# EAGLE design Relay_Board_V3.4 (EAGLE 8.4.2)

## Sheet 1 of 2
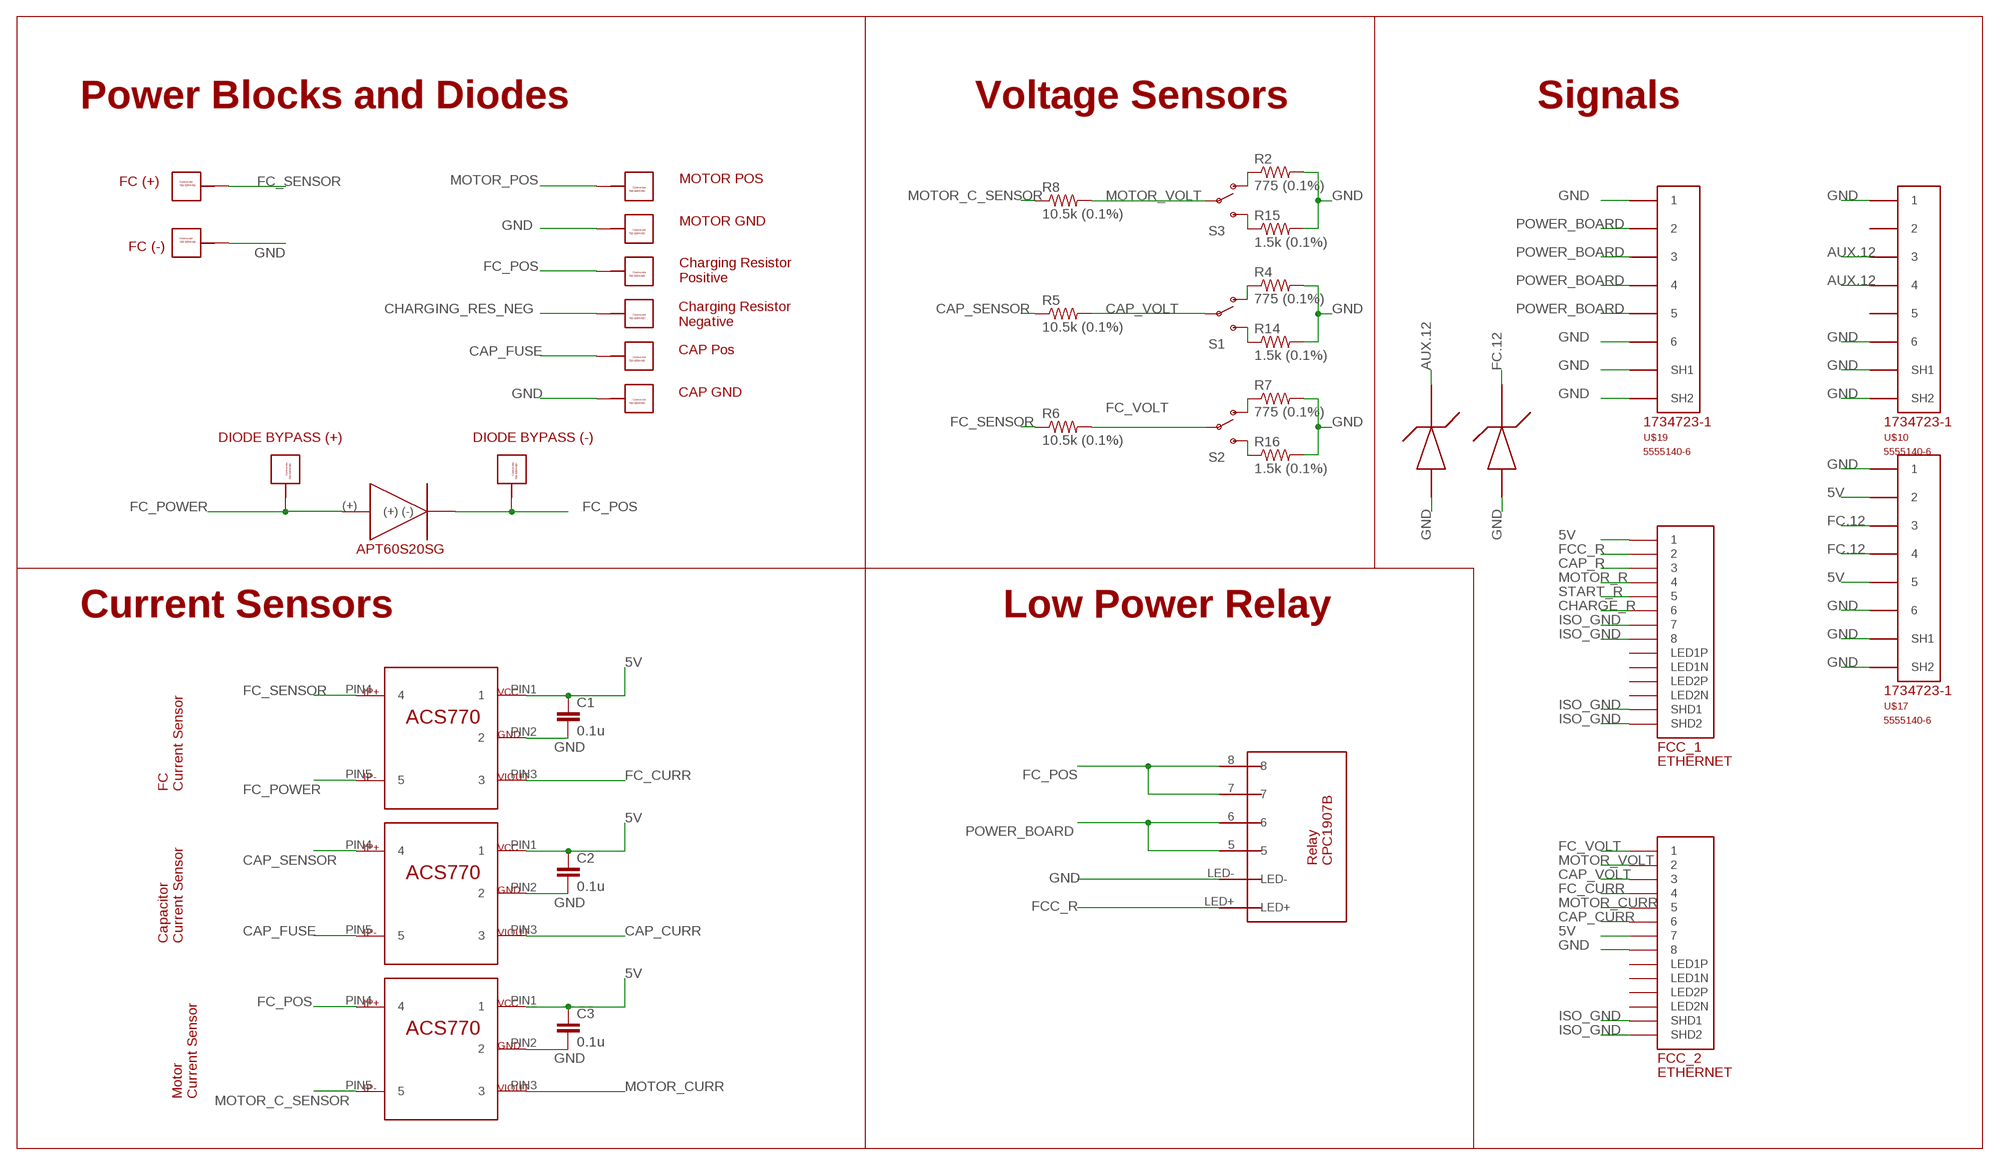
[diagram p0: schematic, sheet 1]

### Parts
C1  0.1u  CAP0603-CAP  [0603-CAP]
C2  0.1u  CAP0603-CAP  [0603-CAP]
C3  0.1u  CAP0603-CAP  [0603-CAP]
CAP.GND  732-3204-ND_CONNECTOR  [732-3204-ND]
CAP.POS  732-3204-ND_CONNECTOR  [732-3204-ND]
CAP.POS1  732-3204-ND_CONNECTOR  [732-3204-ND]
CAP.POS2  732-3204-ND_CONNECTOR  [732-3204-ND]
D1  APT60S20SG  [TO268]
FC.GND  732-3204-ND_CONNECTOR  [732-3204-ND]
FC.POS  732-3204-ND_CONNECTOR  [732-3204-ND]
FCC_1  ETHERNET  [A122645-ND]
FCC_2  ETHERNET  [A122645-ND]
MOTOR.GROUND  732-3204-ND_CONNECTOR  [732-3204-ND]
MOTOR.POSITIVE  732-3204-ND_CONNECTOR  [732-3204-ND]
R2  775 (0.1%)  R-US_R0805  [R0805]
R4  775 (0.1%)  R-US_R0805  [R0805]
R5  10.5k (0.1%)  R-US_R0805  [R0805]
R6  10.5k (0.1%)  R-US_R0805  [R0805]
R7  775 (0.1%)  R-US_R0805  [R0805]
R8  10.5k (0.1%)  R-US_R0805  [R0805]
R14  1.5k (0.1%)  R-US_R0805  [R0805]
R15  1.5k (0.1%)  R-US_R0805  [R0805]
R16  1.5k (0.1%)  R-US_R0805  [R0805]
RES.NEG  732-3204-ND_CONNECTOR  [732-3204-ND]
RES.POS  732-3204-ND_CONNECTOR  [732-3204-ND]
S1  SWITCH-SPDTPTH  [SWITCH-SPDT]
S2  SWITCH-SPDTPTH  [SWITCH-SPDT]
S3  SWITCH-SPDTPTH  [SWITCH-SPDT]
U$7  ACS770LCB_CURRENTSENSOR  [ACS770LCB_CURRENTSENSOR]
U$8  ACS770LCB_CURRENTSENSOR  [ACS770LCB_CURRENTSENSOR]
U$9  ACS770LCB_CURRENTSENSOR  [ACS770LCB_CURRENTSENSOR]
U$10  5555140-6  [1734723-1_RJ11]
U$15  P6KE15A-E3/54GICT-ND_TVS_DIODE  [P6KE15A-E3/54GICT-ND_TVS_DIODE]
U$16  P6KE15A-E3/54GICT-ND_TVS_DIODE  [P6KE15A-E3/54GICT-ND_TVS_DIODE]
U$17  5555140-6  [1734723-1_RJ11]
U$19  5555140-6  [1734723-1_RJ11]
U$22  RELAY-CPC1907B  [RELAY-CPC1907B]

### Nets
5V: C1.1 C2.1 C3.1 FCC_1.P$1 FCC_2.P$7 U$7.PIN1 U$8.PIN1 U$9.PIN1 U$17.2 U$17.5
AUX.12: U$10.3 U$10.4 U$16.P$2(P(-)) ; also sheet 2
CAP_CURR: FCC_2.P$6 U$8.PIN3
CAP_FUSE: CAP.POS.P$1 CAP.POS.P$2 CAP.POS.P$3 CAP.POS.P$4 CAP.POS.P$5 CAP.POS.P$6 CAP.POS.P$7 CAP.POS.P$8 CAP.POS.P$9 CAP.POS.P$10 U$8.PIN5
CAP_R: FCC_1.P$3 ; also sheet 2
CAP_SENSOR: R5.1 U$8.PIN4 ; also sheet 2
CAP_VOLT: FCC_2.P$3 R5.2 S1.2(P)
CHARGE_R: FCC_1.P$6 ; also sheet 2
CHARGING_RES_NEG: RES.NEG.P$1 RES.NEG.P$2 RES.NEG.P$3 RES.NEG.P$4 RES.NEG.P$5 RES.NEG.P$6 RES.NEG.P$7 RES.NEG.P$8 RES.NEG.P$9 RES.NEG.P$10 ; also sheet 2
FC.12: U$15.P$2(P(-)) U$17.3 U$17.4 ; also sheet 2
FC_CURR: FCC_2.P$4 U$7.PIN3
FC_POS: CAP.POS2.P$1 CAP.POS2.P$2 CAP.POS2.P$3 CAP.POS2.P$4 CAP.POS2.P$5 CAP.POS2.P$6 CAP.POS2.P$7 CAP.POS2.P$8 CAP.POS2.P$9 CAP.POS2.P$10 D1.(-) D1.C@1((-)) D1.C@2((-)) RES.POS.P$1 RES.POS.P$2 RES.POS.P$3 RES.POS.P$4 RES.POS.P$5 RES.POS.P$6 RES.POS.P$7 RES.POS.P$8 RES.POS.P$9 RES.POS.P$10 U$9.PIN4 U$22.7 U$22.8 ; also sheet 2
FC_POWER: CAP.POS1.P$1 CAP.POS1.P$2 CAP.POS1.P$3 CAP.POS1.P$4 CAP.POS1.P$5 CAP.POS1.P$6 CAP.POS1.P$7 CAP.POS1.P$8 CAP.POS1.P$9 CAP.POS1.P$10 D1.(+) U$7.PIN5
FC_SENSOR: FC.POS.P$1 FC.POS.P$2 FC.POS.P$3 FC.POS.P$4 FC.POS.P$5 FC.POS.P$6 FC.POS.P$7 FC.POS.P$8 FC.POS.P$9 FC.POS.P$10 R6.1 U$7.PIN4
FC_VOLT: FCC_2.P$1 R6.2 S2.2(P)
FCC_R: FCC_1.P$2 U$22.LED+
GND: C1.2 C2.2 C3.2 CAP.GND.P$1 CAP.GND.P$2 CAP.GND.P$3 CAP.GND.P$4 CAP.GND.P$5 CAP.GND.P$6 CAP.GND.P$7 CAP.GND.P$8 CAP.GND.P$9 CAP.GND.P$10 FC.GND.P$1 FC.GND.P$2 FC.GND.P$3 FC.GND.P$4 FC.GND.P$5 FC.GND.P$6 FC.GND.P$7 FC.GND.P$8 FC.GND.P$9 FC.GND.P$10 FCC_2.P$8 MOTOR.GROUND.P$1 MOTOR.GROUND.P$2 MOTOR.GROUND.P$3 MOTOR.GROUND.P$4 MOTOR.GROUND.P$5 MOTOR.GROUND.P$6 MOTOR.GROUND.P$7 MOTOR.GROUND.P$8 MOTOR.GROUND.P$9 MOTOR.GROUND.P$10 R2.2 R4.2 R7.2 R14.2 R15.2 R16.2 U$7.PIN2 U$8.PIN2 U$9.PIN2 U$10.1 U$10.6 U$10.SH1 U$10.SH2 U$15.P$1(P(+)) U$16.P$1(P(+)) U$17.1 U$17.6 U$17.SH1 U$17.SH2 U$19.1 U$19.6 U$19.SH1 U$19.SH2 U$22.LED- ; also sheet 2
ISO_GND: FCC_1.P$7 FCC_1.P$8 FCC_1.P$13(SHD1) FCC_1.P$14(SHD2) FCC_2.P$13(SHD1) FCC_2.P$14(SHD2) ; also sheet 2
MOTOR_C_SENSOR: R8.1 U$9.PIN5 ; also sheet 2
MOTOR_CURR: FCC_2.P$5 U$9.PIN3
MOTOR_POS: MOTOR.POSITIVE.P$1 MOTOR.POSITIVE.P$2 MOTOR.POSITIVE.P$3 MOTOR.POSITIVE.P$4 MOTOR.POSITIVE.P$5 MOTOR.POSITIVE.P$6 MOTOR.POSITIVE.P$7 MOTOR.POSITIVE.P$8 MOTOR.POSITIVE.P$9 MOTOR.POSITIVE.P$10 ; also sheet 2
MOTOR_R: FCC_1.P$4 ; also sheet 2
MOTOR_VOLT: FCC_2.P$2 R8.2 S3.2(P)
N$9: R4.1 S1.1(O)
N$10: R14.1 S1.3(S)
N$11: R2.1 S3.1(O)
N$12: R15.1 S3.3(S)
N$16: R7.1 S2.1(O)
N$17: R16.1 S2.3(S)
POWER_BOARD: U$19.2 U$19.3 U$19.4 U$19.5 U$22.5 U$22.6
START_R: FCC_1.P$5 ; also sheet 2
Unconnected: FCC_1.P$9(LED1N) FCC_1.P$10(LED1P) FCC_1.P$11(LED2N) FCC_1.P$12(LED2P) FCC_2.P$9(LED1N) FCC_2.P$10(LED1P) FCC_2.P$11(LED2N) FCC_2.P$12(LED2P) U$10.2 U$10.5

### Notes on the sheet
- Power Blocks and Diodes | Voltage Sensors | Signals
- FC (+) | MOTOR POS
- MOTOR GND
- FC (-)
- Charging Resistor
  Positive
- Charging Resistor
  Negative
- CAP Pos
- CAP GND
- DIODE BYPASS (+) | DIODE BYPASS (-)
- Current Sensors | Low Power Relay
- FC
  Current Sensor
- Capacitor
  Current Sensor
- Motor
  Current Sensor

## Sheet 2 of 2
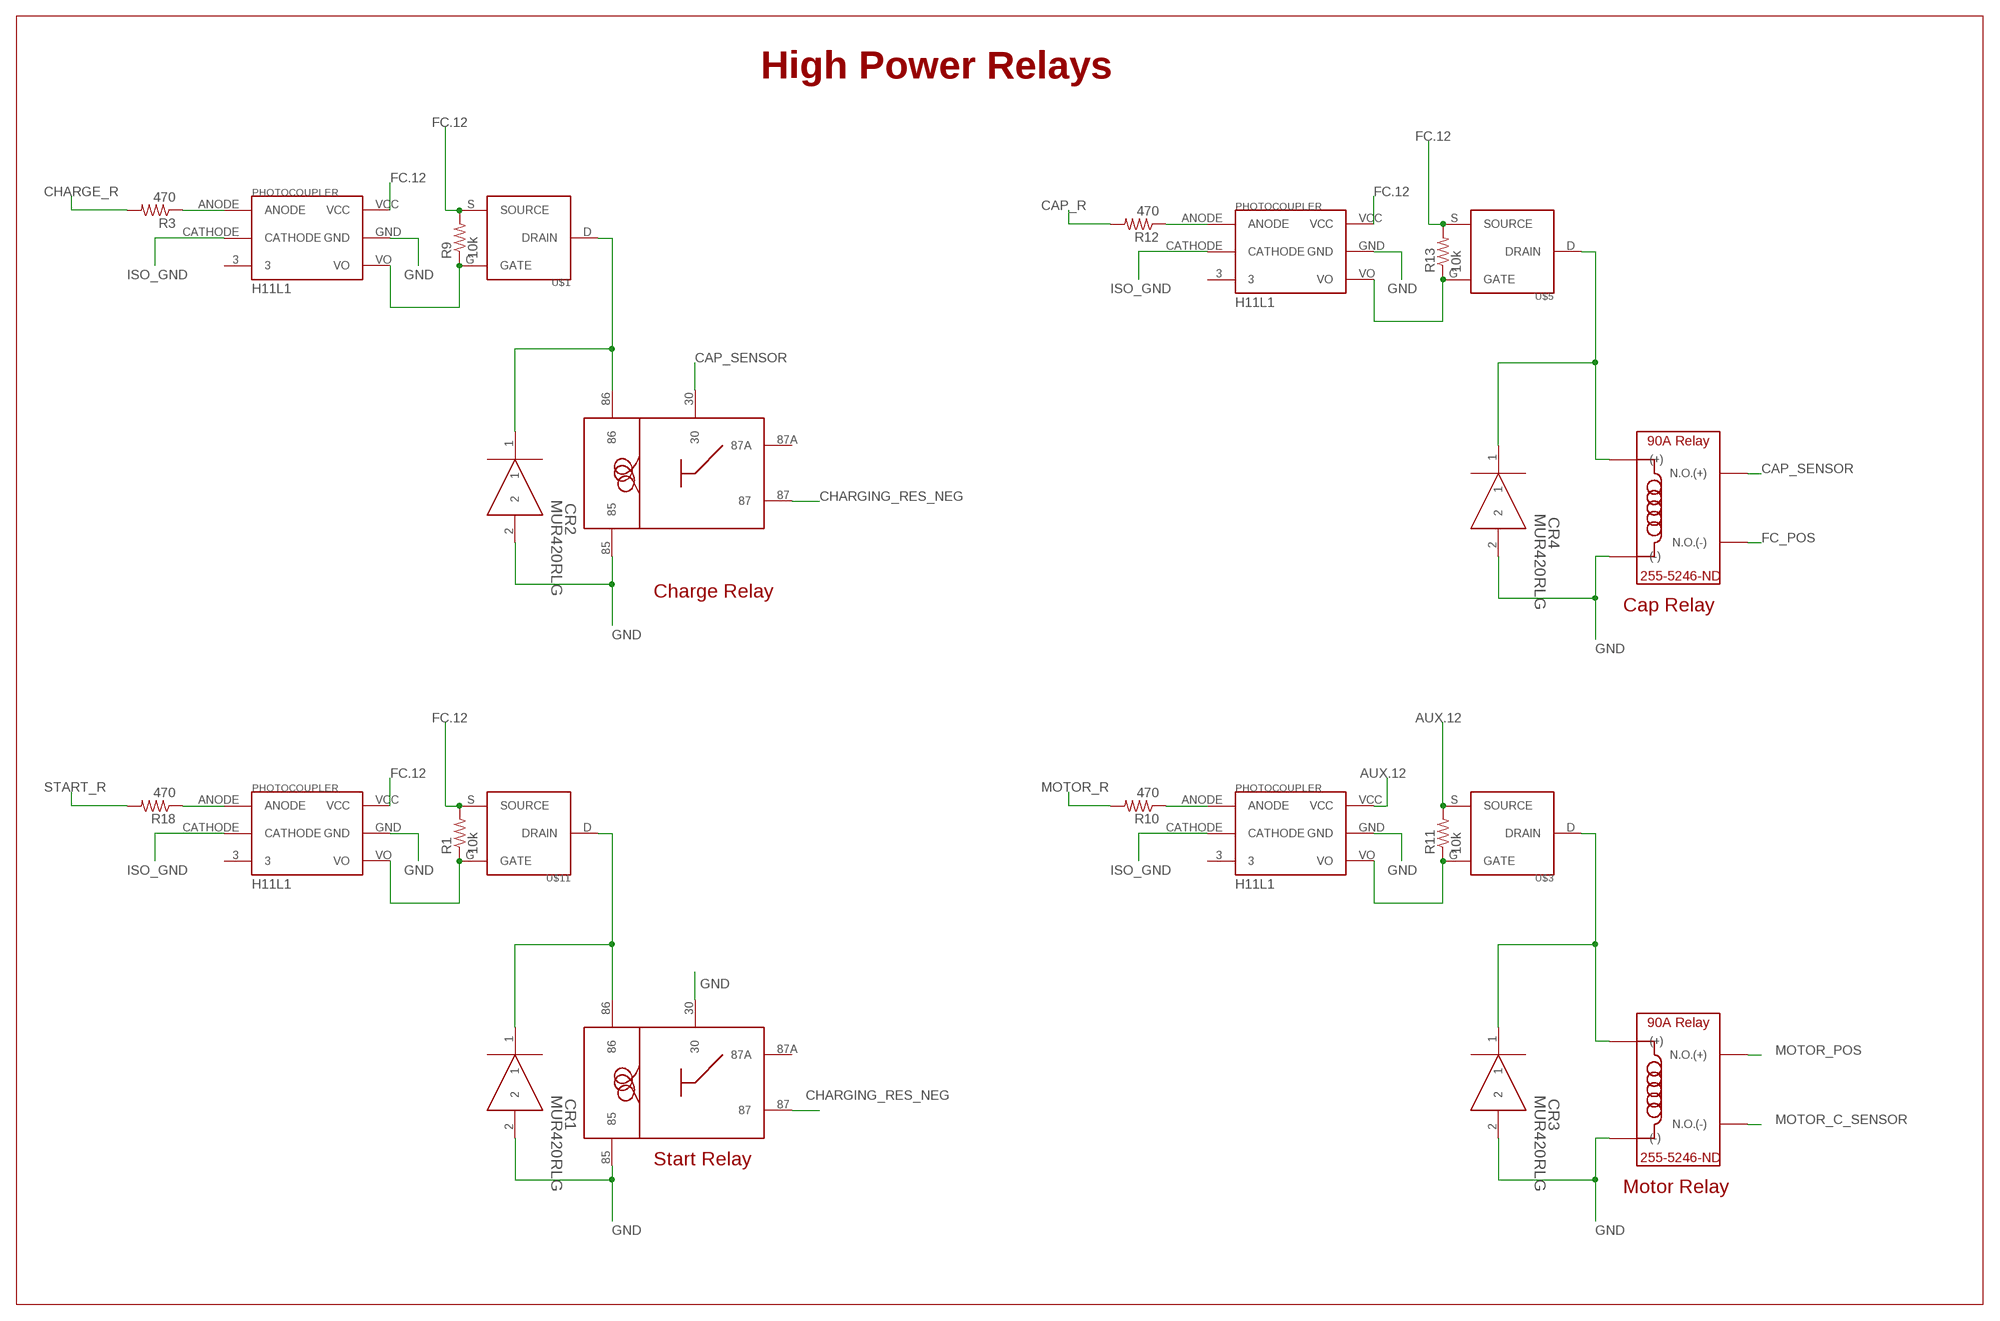
[diagram p1: schematic, sheet 2]

### Parts
CR1  MUR420RLG  [DO-201AD]
CR2  MUR420RLG  [DO-201AD]
CR3  MUR420RLG  [DO-201AD]
CR4  MUR420RLG  [DO-201AD]
R1  10k  RESISTOR0603-RES  [0603-RES]
R3  470  RESISTOR0603-RES  [0603-RES]
R9  10k  RESISTOR0603-RES  [0603-RES]
R10  470  RESISTOR0603-RES  [0603-RES]
R11  10k  RESISTOR0603-RES  [0603-RES]
R12  470  RESISTOR0603-RES  [0603-RES]
R13  10k  RESISTOR0603-RES  [0603-RES]
R18  470  RESISTOR0603-RES  [0603-RES]
START.RELAY1  VCF4-1000  [VCF4-1000]
START.RELAY2  VCF4-1000  [VCF4-1000]
U$1  DMP3056L-7DMP3056L-7  [DMP3056L-7]
U$2  H11L1H11L1  [H11L1]
U$3  DMP3056L-7DMP3056L-7  [DMP3056L-7]
U$4  H11L1H11L1  [H11L1]
U$5  DMP3056L-7DMP3056L-7  [DMP3056L-7]
U$6  H11L1H11L1  [H11L1]
U$11  DMP3056L-7DMP3056L-7  [DMP3056L-7]
U$12  H11L1H11L1  [H11L1]
U$13  255-5246-ND  [255-5246-ND]
U$14  255-5246-ND  [255-5246-ND]

### Nets
AUX.12: R11.2 U$3.S(SOURCE) U$4.VCC ; also sheet 1
CAP_R: R12.2 ; also sheet 1
CAP_SENSOR: START.RELAY2.30 U$13.NO(+)(N.O.(+)) U$13.NO(++)(N.O.(+)) ; also sheet 1
CHARGE_R: R3.2 ; also sheet 1
CHARGING_RES_NEG: START.RELAY1.87 START.RELAY2.87 ; also sheet 1
FC.12: R1.2 R9.2 R13.2 U$1.S(SOURCE) U$2.VCC U$5.S(SOURCE) U$6.VCC U$11.S(SOURCE) U$12.VCC ; also sheet 1
FC_POS: U$13.NO(-)(N.O.(-)) U$13.NO(--)(N.O.(-)) ; also sheet 1
GND: CR1.2 CR2.2 CR3.2 CR4.2 START.RELAY1.30 START.RELAY1.85 START.RELAY2.85 U$2.GND U$4.GND U$6.GND U$12.GND U$13.(-) U$13.(--)((-)) U$14.(-) U$14.(--)((-)) ; also sheet 1
ISO_GND: U$2.CATHODE U$4.CATHODE U$6.CATHODE U$12.CATHODE ; also sheet 1
MOTOR_C_SENSOR: U$14.NO(-)(N.O.(-)) U$14.NO(--)(N.O.(-)) ; also sheet 1
MOTOR_POS: U$14.NO(+)(N.O.(+)) U$14.NO(++)(N.O.(+)) ; also sheet 1
MOTOR_R: R10.2 ; also sheet 1
N$1: R9.1 U$1.G(GATE) U$2.VO
N$2: R3.1 U$2.ANODE
N$3: CR2.1 START.RELAY2.86 U$1.D(DRAIN)
N$4: R11.1 U$3.G(GATE) U$4.VO
N$5: R10.1 U$4.ANODE
N$6: CR3.1 U$3.D(DRAIN) U$14.(+) U$14.(++)((+))
N$7: R13.1 U$5.G(GATE) U$6.VO
N$8: R12.1 U$6.ANODE
N$13: CR4.1 U$5.D(DRAIN) U$13.(+) U$13.(++)((+))
N$21: R1.1 U$11.G(GATE) U$12.VO
N$23: R18.1 U$12.ANODE
N$30: CR1.1 START.RELAY1.86 U$11.D(DRAIN)
START_R: R18.2 ; also sheet 1
Unconnected: START.RELAY1.87A START.RELAY2.87A U$2.3 U$4.3 U$6.3 U$12.3

### Notes on the sheet
- High Power Relays
- Charge Relay
- Cap Relay
- Start Relay
- Motor Relay

## Library data of the parts
C1-C3 = SparkFun-Passives:CAP: Capacitor Standard 0603 ceramic capacitor, and 0.1" leaded capacitor.
CAP.GND CAP.POS CAP.POS1 CAP.POS2 FC.GND FC.POS MOTOR.GROUND MOTOR.POSITIVE RES.NEG RES.POS = Connector 732-3204:732-3204-ND_CONNECTOR
CR1-CR4 = MUR420RLG - Diode:MUR420RLG; MANUFACTURER_PART_NUMBER: MUR420RLG; VENDOR: ON Semiconductor
D1 = Diode - APT60S20SG:APT60S20SG
FCC_1 FCC_2 = ETHERNET-3:ETHERNET: Ethernet port with 2 leds. digikey number A122645-ND
R1 R3 R9-R13 R18 = SparkFun:RESISTOR: Resistor Basic schematic elements and footprints for 0603, 1206, and PTH resistors.
R2 R4-R8 R14-R16 = Resistor:R-US_: RESISTOR, American symbol
S1-S3 = SparkFun-Electromechanical:SWITCH-SPDT: SPDT Switch Simple slide switch, Spark Fun Electronics SKU : COM-00102 DPDT SMT slide switch, AYZ0202, SWCH-08179; PROD_ID: SWCH-08261
START.RELAY1 START.RELAY2 = VCF4-1000:VCF4-1000: Part for the VCF4-1000 relay socket. Digi-Key Part Number: PB232-ND. Pin numbering is directly taken from the data sheet of the relay. Relay Digi-Key Part Number: 255-2083-ND (Also works with 255-1825-ND). If using relay 255-1825-ND, ignore pin 87A.
U$1 U$3 U$5 U$11 = DMP3056L-7:DMP3056L-7
U$2 U$4 U$6 U$12 = FCC_parts:H11L1
U$7-U$9 = ACS770 Current Sensor:ACS770LCB_CURRENTSENSOR
U$10 U$17 U$19 = 5555140-6 RJ11:5555140-6
U$13 U$14 = Relay 255-5246-ND:255-5246-ND
U$15 U$16 = TVS Diode Through-Hole:P6KE15A-E3/54GICT-ND_TVS_DIODE
U$22 = Relay_CPC1907B:RELAY-CPC1907B

## Board
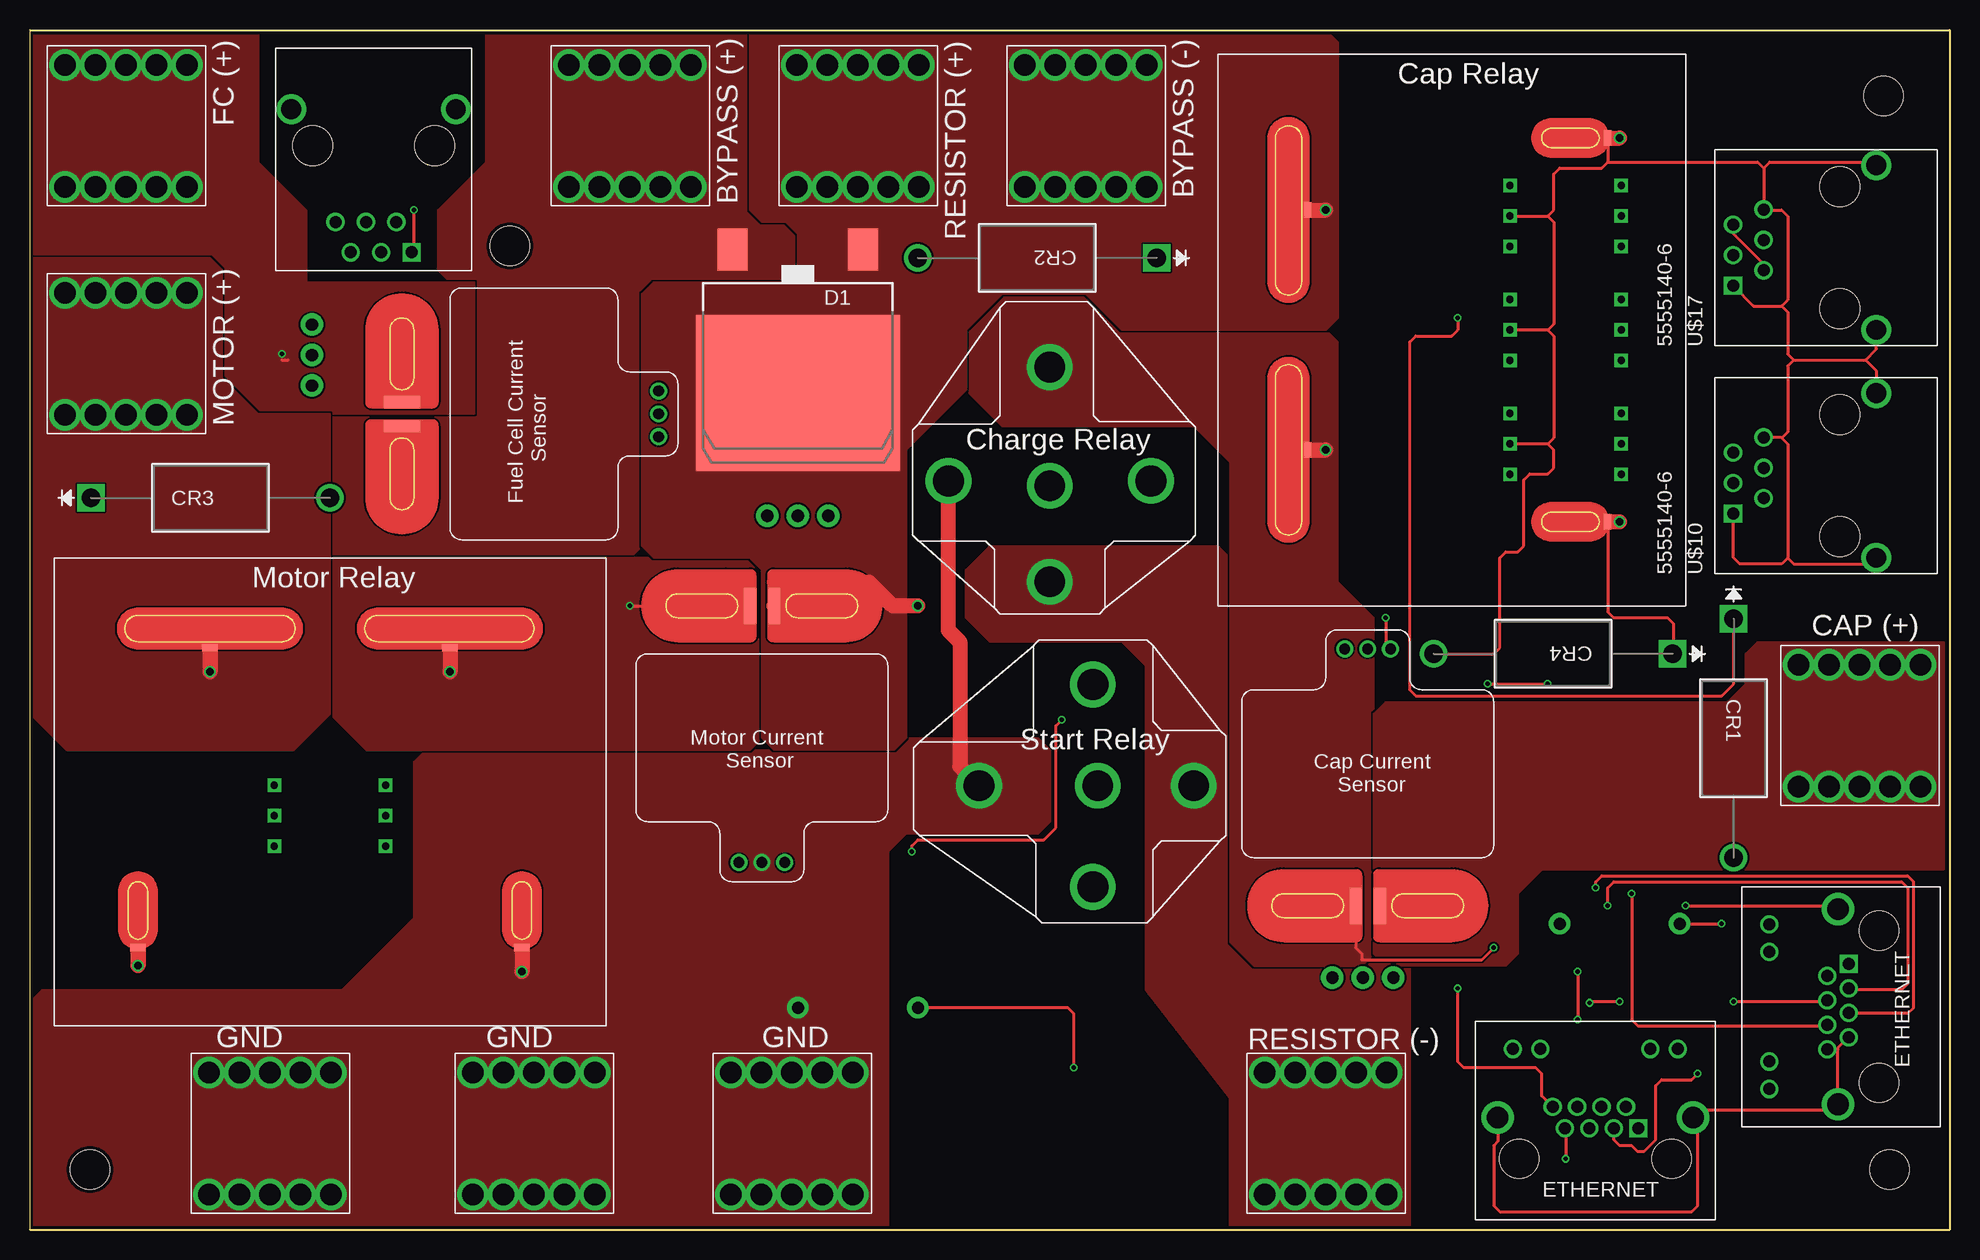
[diagram p2: board, top side]
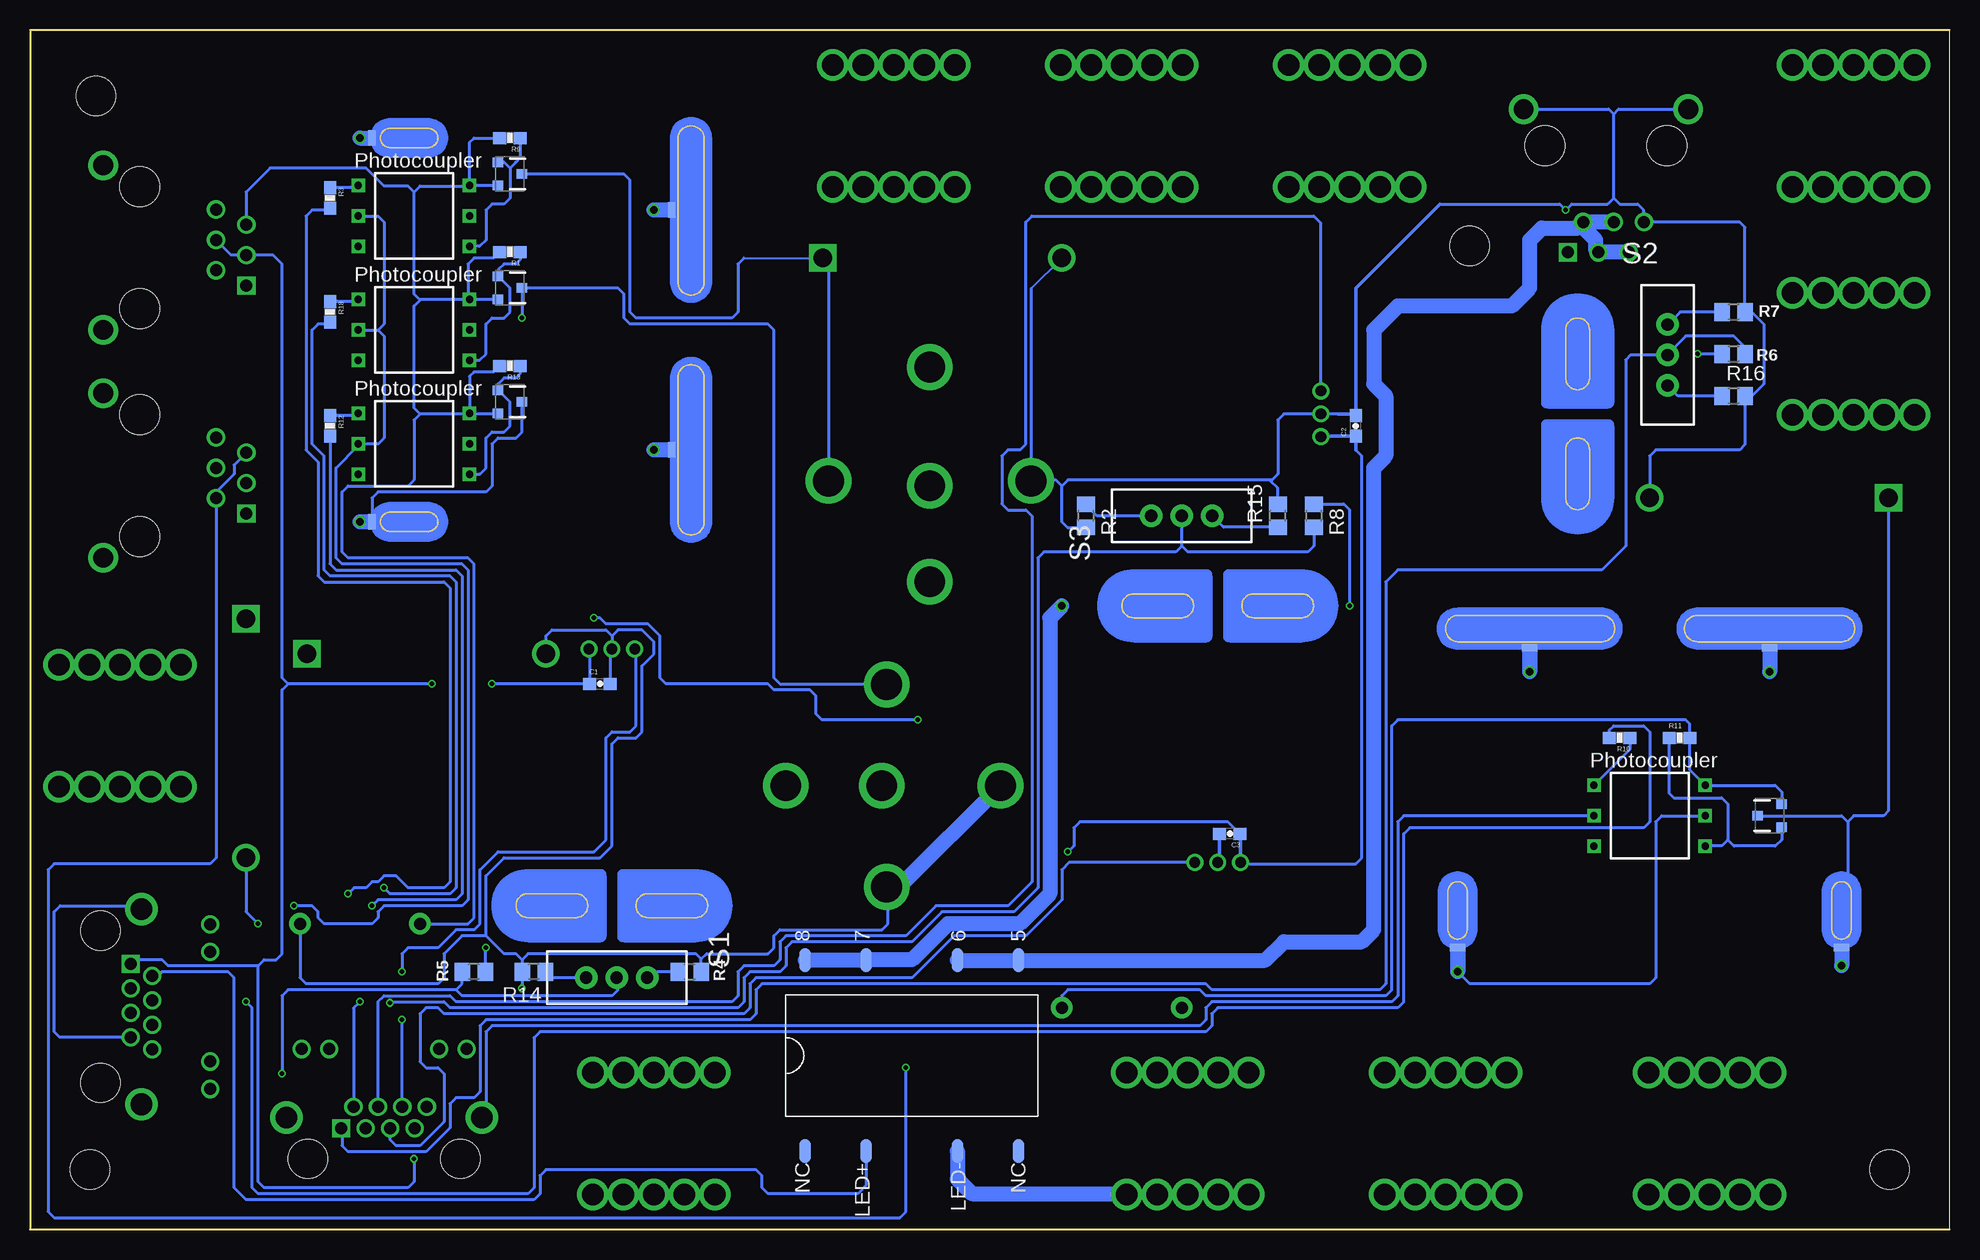
[diagram p3: board, bottom side, seen from below]

Size 160 x 100 mm. Coordinates in mm from the lower left corner, seen from the top.
Outline: 0,0 0,100 160,100 160,0 0,0
Copper layers (1*16): Top 0.035mm / dielectric 1.5mm / Bottom 0.035mm
Design rules "SeeedStudio_2layer_DRU_no_angle_20140221": minimum track width 6mil, minimum drill 12mil, track to track 6mil, track to pad 6mil, pad to pad 6mil, via to via 6mil, smd to smd 0mil, copper to edge 10mil, drill to drill 10mil, minimum pad ring 10mil, minimum via ring 6mil, stop-mask expansion 2mil, vias tented up to drill 100mil, thermal gap 10mil

### Footprints (pad centres in the part's own frame; a part is rotated, then mirrored left to right if it is on the bottom)
0603-CAP = smd 1.1 x 1: 1 -0.85,0; 2 0.85,0
732-3204-ND = drill 1.76: P$1 -5.08,5.08; P$2 -2.54,5.08; P$3 0,5.08; P$4 2.54,5.08; P$5 5.08,5.08; P$6 5.08,-5.08; P$7 2.54,-5.08; P$8 0,-5.08; P$9 -2.54,-5.08; P$10 -5.08,-5.08
DO-201AD = drill 1.549 pad 2.057 square: 1 -19.914,0 | drill 1.549 pad 2.057: 2 0,0
TO268 = smd 2.5 x 3.5: (+) 5.45,-9.7; (-) -5.45,-9.7 | smd 8.5 x 13: C@1 -4.25,2.25; C@2 4.25,2.25
A122645-ND = drill 1 square: P$1 3.58,2.54 | drill 1: P$2 2.56,4.32; P$3 1.54,2.54; P$4 0.52,4.32; P$5 -0.5,2.54; P$6 -1.52,4.32; P$7 -2.54,2.54; P$8 -3.56,4.32; P$9 -6.86,9.14; P$10 -4.57,9.14; P$11 4.57,9.14; P$12 6.86,9.14 | drill 1.8: P$13 -8.13,3.43; P$14 8.13,3.43 | hole 3.25: -6.35,0; 6.35,0
0603-RES = smd 1.1 x 1: 1 -0.85,0; 2 0.85,0
R0805 = smd 1.3 x 1.5: 1 -0.95,0; 2 0.95,0
SWITCH-SPDT = drill 1.016 pad 1.88: 1 0,2.54; 2 0,0; 3 0,-2.54
VCF4-1000 = drill 2.57 pad 3.81: 30 -17.9,0; 85 -8.407,-8.445; 86 -8.407,8.445; 87 0,0; 87A -8,0
DMP3056L-7 = smd 0.8 x 0.9: D 0,1; G -0.95,-1; S 0.95,-1
H11L1 = drill 0.6 square: 3 -4.635,-2.54; ANODE -4.635,2.54; CATHODE -4.635,0; GND 4.635,0; VCC 4.635,2.54; VO 4.635,-2.54
ACS770LCB_CURRENTSENSOR = drill 0.9: PIN1 -1.91,-21.4; PIN2 0,-21.4; PIN3 1.91,-21.4 | smd 1 x 3: PIN4 1,0; PIN5 -1,0
1734723-1_RJ11 = drill 1 square: 1 -3.81,2.54 | drill 1: 2 -1.27,2.54; 3 1.27,2.54; 4 -2.54,0; 5 0,0; 6 2.54,0 | drill 1.65: SH1 -7.5,-9.4; SH2 6.22,-9.4 | hole 3.3: -5.72,-6.35; 4.44,-6.35
255-5246-ND = smd 1.27 x 0.635: (+) -16,-25.5; (-) 16,-25.5; NO(+) -10,-0.5; NO(-) 10,-0.5 | smd 1.27 x 0.635 bottom: (++) -16,-25.5; (--) 16,-25.5; NO(++) -10,-0.5; NO(--) 10,-0.5
P6KE15A-E3/54GICT-ND_TVS_DIODE = drill 1 pad 1.778: P$1 -5,0; P$2 5,0
STAND-OFF = hole 3.302: 0,0
RELAY-CPC1907B = smd 2 x 0.95: 5 7.95,-8.891; 6 7.95,-3.809; 7 7.95,3.811; 8 7.95,8.891; LED+ -7.95,3.811; LED- -7.95,-3.811; NC_1 -7.95,8.891; NC_2 -7.95,-8.891

### Placement (x,y rotation side)
C1  112.5,45.5 0 bottom
C2  49.5,67 90 bottom
C3  60,33 180 bottom
CAP.GND  20,8 0 top
CAP.POS  152.5,42 0 top
CAP.POS1  50,92 0 top
CAP.POS2  88,92 0 top
CR1  142,31 270 top
CR2  74,81 180 top
CR3  25,61 0 top
CR4  117,48 180 top
D1  64,72 180 top
FC.GND  63.5,8 0 top
FC.POS  8,92 0 top
FCC_1  154.13,18.57 90 top
FCC_2  130.48,5.9 0 top
MOTOR.GROUND  42,8 0 top
MOTOR.POSITIVE  8,73 0 top
R1  120,81.5 180 bottom
R2  72,59.5 270 bottom
R3  135,86 270 bottom
R4  105,21.5 0 bottom
R5  123,21.5 180 bottom
R6  18,73 0 bottom
R7  18,76.5 0 bottom
R8  53,59.5 270 bottom
R9  120,91 180 bottom
R10  27.5,41 180 bottom
R11  22.5,41 0 bottom
R12  135,67 270 bottom
R13  120,72 180 bottom
R14  118,21.5 180 bottom
R15  56,59.5 90 bottom
R16  18,69.5 0 bottom
R18  135,76.5 270 bottom
RES.NEG  108,8 0 top
RES.POS  69,92 0 top
S1  111.1,21 270 bottom
S2  23.5,72.9 0 bottom
S3  64,59.5 90 bottom
START.RELAY1  97,37 0 top
START.RELAY2  85,54 270 top
U$1  120,88 270 bottom
U$2  128,84.5 0 bottom
U$3  15,34.5 90 bottom
U$4  25,34.5 0 bottom
U$5  120,69 270 bottom
U$6  128,65.5 0 bottom
U$7  31,68 90 top
U$8  111.5,27 180 top
U$9  61,52 0 top
U$10  144.5,63.5 90 top
U$11  120,78.5 270 bottom
U$12  128,75 0 bottom
U$13  106,75 90 top
U$14  25,49 0 top
U$15  132.5,25.5 180 top
U$16  69,18.5 0 top
U$17  144.5,82.5 90 top
U$18  [STAND-OFF]  5,5 0 top
U$19  28,84 180 top
U$20  [STAND-OFF]  155,5 0 top
U$21  [STAND-OFF]  154.5,94.5 0 top
U$22  86.5,14.5 90 bottom
U$23  [STAND-OFF]  40,82 0 top

### Tracks (layer width: path | path; a pad name or v marks a point on that pad's centre or on a via)
5V  (via drill 0.35)
  Top 0.254: v121.5,45.5 v126.5,45.5 | FCC_2.P$7 128,8.38 v128,5.89 | v73.5,31.5 73.5,32 74,32.5 84.5,32.5 85.5,33.5 85.5,42 v86,42.5 | v113,51 113,49 U$8.PIN1
  Bottom 0.254: U$9.PIN1 59,30.5 49.5,30.5 49,31 49,64.5 49.5,65 | U$8.PIN1 113.35,48.34 C1.1 v121.5,45.5 | 138.5,45.5 139,45 139,23 139.5,22.5 140.5,22.5 141,22 | v126.5,45.5 138.5,45.5 | 138.5,45.5 139,46 139,80 139,80.5 139.73,81.23 U$17.2 143.23,81.23 U$17.5 | v128,5.89 128,4 128.5,3.5 140.5,3.5 141,4 141,22 | 141,22 148.5,22 149,22.5 151,22.5 151.35,22.15 FCC_1.P$1 | C3.1 60.15,34 72.5,34 73,33.5 73,32 v73.5,31.5 | v86,42.5 94,42.5 94.5,43 94.5,44.5 95,45 98,45 98.5,45.5 107,45.5 107.5,46 107.5,49.5 108.5,50.5 112,50.5 112.5,51 v113,51
  Bottom 0.305: 49.5,65 C2.1 52.34,66.15 U$7.PIN1 | C3.1 59.09,32.95 U$9.PIN1
AUX.12  (via drill 0.35)
  Top 0.254: v87,13.5 87,18 86.5,18.5 U$16.P$2
  Bottom 0.254: U$3.S 14,36.5 14.54,37.04 U$4.VCC 21.65,38.33 R11.2 21.65,42.15 22,42.5 46,42.5 46.5,42 46.5,20 47,19.5 62,19.5 62.5,20 73.5,20 74,19.5 U$16.P$2 | v87,13.5 87,1.5 87.5,1 158,1 158.5,1.5 158.5,30 158,30.5 145,30.5 144.5,31 U$10.4 144.5,61.5 143,63 143,63.73 U$10.3
CAP_CURR  (via drill 0.35)
  Top 0.254: v129,21.5 v129,17.5
  Bottom 0.254: U$8.PIN3 109.5,48.31 109.5,42 110,41.5 111.5,41.5 112,41 112,32.5 113,31.5 121,31.5 122.5,30 122.5,25.5 123,25 124.5,25 126,23.5 128.5,23.5 129,23 v129,21.5 | FCC_2.P$6 129,10.26 v129,17.5
CAP_FUSE
  pour Top (no thermals): 113,22 112,23 112,43 113,44 141.5,44 143,45.5 143,48 144,49 159.5,49 159.5,30 126,30 124,28 124,23 123,22
CAP_R  (via drill 0.35)
  Top 0.254: v131.5,27 131.5,28.5 132,29 156,29 156.5,28.5 156.5,20.5 156,20 151.7,20 FCC_1.P$3
  Bottom 0.254: R12.2 135,55.5 134.5,55 124.5,55 124,54.5 124,28 124.5,27.5 131,27.5 v131.5,27
CAP_SENSOR  (via drill 0.35, 0.65)
  Top 0.254: U$8.PIN4 110.5,23.5 111,23 111,22.5 121,22.5 v122,23.5
  Top 1.27: U$13.NO(++) v108,65
  Bottom 0.254: v122,23.5 122.05,23.45 R5.1
  Bottom 1.27: U$13.NO(++) v108,65
  pour Top (rank 2, no thermals): 78,70 81,67 97,67 98,66 100,64 100,25 100,24 102,22 111,22 112,23 112,43 112,51 110,53 109,54 109,74 108,75 91,75 88,78 81,78 78,75
CAP_VOLT  (via drill 0.35)
  Top 0.254: v139,13 138.5,12.5 136,12.5 135.5,12 135.5,7.5 134.5,6.5 134,6.5 133.5,7 132.5,7 132.02,7.48 FCC_2.P$3
  Bottom 0.254: S1.2 111.1,20.1 111,20 111.5,19.5 124,19.5 124.5,20 | v139,13 139,19.5 138.5,20 124.5,20 | R5.2 124,21.45 124,20.5 124.5,20
CHARGE_R  (via drill 0.35)
  Top 0.254: v133.5,28 133.5,17.5 134,17 149.76,17 FCC_1.P$6
  Bottom 0.254: R3.2 135.15,85 136.5,85 137,84.5 137,65 136,64 136,54.5 135.5,54 125.5,54 125,53.5 125,29 125.5,28.5 128.5,28.5 129.5,29.5 130.5,29.5 131,29 131.5,29 132,28.5 133,28.5 v133.5,28
CHARGING_RES_NEG
  pour Top (rank 4, no thermals): 78,51 78,55 80,57 99,57 101,55 101,23.5 115,23.5 115,0 100,0 100,11 93,20 93,47 91,49 80,49
FC.12
  Top 0.254: U$17.4 144.5,80.5 142,83 142,83.73 U$17.3
  Bottom 0.254: U$1.S U$2.VCC | U$6.VCC U$5.S | U$11.S U$12.VCC 123.5,77.54 | 127.5,68 128,67.5 128,62.5 128.5,62 133.5,62 134,61.5 134,56.5 133.5,56 123.5,56 123,55.5 123,26 123.5,25.5 U$15.P$2 | U$6.VCC 123.41,68 127.5,68 | 127.5,68 128,68.5 128,77 127.5,77.5 | 127.5,77.5 128,78 128,86.5 | 128,86.5 127.5,87 123.41,87 U$2.VCC | 123.5,77.54 127.46,77.54 127.5,77.5 | 121,81.5 R1.2 121.35,81 123,81 123.5,80.5 123.5,77.54 | R9.2 123,91 123.36,90.64 U$2.VCC | R13.2 121.35,71.5 123,71.5 123.36,71.14 U$6.VCC | 128,86.5 128.5,87 130.5,87 132,88.5 140,88.5 142,86.5 142,83.81 U$17.3
FC_CURR
  Bottom 0.254: U$7.PIN3 52.4,83.9 53,84.5 76.5,84.5 77,84 77,65.5 77.5,65 78.5,65 79,64.5 79,60.5 78.5,60 77,60 76.5,59.5 76.5,29 78.5,27 84.5,27 87,24.5 97,24.5 97.5,24 97.5,22.5 98,22 100.5,22 101,21.5 101,19.5 101.5,19 124.5,19 125,19.5 130.5,19.5 131,19 FCC_2.P$4
FC_POS  (via drill 0.65)
  Top 1.27: v74,52 71.91,52 69.95,53.95 62.05,53.95 62.05,52.05 U$9.PIN4 | U$13.NO(--) v108,85
  Bottom 1.27: U$22.8 U$22.7 90.26,22.5 86.5,22.5 83.5,25.5 77.5,25.5 75,28 75,51 v74,52 | U$13.NO(--) v108,85
  pour Top (no thermals): 52,56 51,57 51,78 52,79 63,79 64,80 64,83 63,84 61,84 60,85 60,100 108,100 109,99 109,76 108,75 91,75 88,78 81,78 78,75 78,70 73,65 73,41 72,40 62,40 61,41 61,55 60,56
FC_POWER
  pour Top (rank 4, no thermals): 34,80 34,85 38,89 38,100 60,100 60,85 61,84 63,84 64,83 64,80 63,79 52,79 51,78 51,57 50,56 25,56 25,68 34,68 35,69 35,79
FC_SENSOR  (via drill 0.35)
  Top 0.254: 21,72.5 21.5,72.5
  Bottom 0.254: R6.1 v21,73
  pour Top (rank 2, no thermals): 0,100 19,100 19,89 23,85 23,79 37,79 37,68 19,68 16,71 16,80 15,81 0,81
FC_VOLT
  Bottom 0.254: R6.2 17.05,73.55 18,74.5 22,74.5 23.5,73 S2.2 26.6,72.9 27,72.5 27,57 29,55 46,55 47,54 47,20.5 47.5,20 61.5,20 62,20.5 99,20.5 99.5,20 99.5,18 100,17.5 122,17.5 122.5,17 122.5,11.5 123,11 124.5,11 125,10.5 125,8.5 127,6.5 133.5,6.5 134,7 134,8.5 FCC_2.P$1
FCC_R
  Bottom 0.254: U$22.LED+ 90.31,3.69 91,3 98.5,3 99,3.5 99,4.5 99.5,5 117,5 117.5,4.5 117.5,3 118,2.5 142,2.5 143,3.5 143,21 143.5,21.5 149,21.5 149.37,21.13 FCC_1.P$2
GND  (via drill 0.35, 0.65)
  Top 0.254: U$13.(--) 131.5,89 | 126.5,75 127,75.5 127,84 126.5,84.5 | 126.5,75 127,74.5 127,66 126.5,65.5 | U$2.GND 126.5,84.5 | 126.5,84.5 127,85 127,88 127.5,88.5 131,88.5 131.5,89 | 126.5,65.5 U$6.GND | 126.5,65.5 127,65 127,63.5 126.5,63 125,63 124.5,62.5 124.5,57 124,56.5 123,56.5 122.5,56 122.5,48.5 122,48 CR4.2 | 126.5,75 U$12.GND | 131.5,89 144,89 144.5,88.5 | 144.5,88.5 145,89 153.62,89 U$17.SH2 | 146,77 146.5,77.5 146.5,84.5 146,85 144.54,85 U$17.6 144.5,88.5 | 146,77 146.5,76.5 146.5,73 147,72.5 | 147,72.5 146.5,72 146.5,66.5 146,66 | 147,72.5 153,72.5 | U$17.SH1 153.9,73.4 153,72.5 | 153,72.5 153.9,71.6 U$10.SH2 | FCC_2.P$8 126,11.14 126,13 125.5,13.5 119.5,13.5 119,14 v119,20.11 | 146.5,56 147,55.5 153.4,55.5 U$10.SH1 | U$15.P$1 v141,25.5 | U$17.1 143.65,77 146,77 | 146,66 146.5,65.5 146.5,56 | 146,66 145.96,66.04 U$10.6 | 146.5,56 146,55.5 142.5,55.5 141.96,56.04 U$10.1 | U$19.1 32,81.65 v32,85
  Top 0.305: 80.15,37 START.RELAY1.30
  Top 1.27: START.RELAY1.30 77.5,38.6 77.5,49 76.56,49.95 START.RELAY2.85 | U$13.(--) v132.5,91 | U$14.(--) v41,21.5
  Bottom 0.152: CR2.2 76.56,78.44
  Bottom 0.254: 17,69.5 R16.2 | R16.2 16.5,69.5 15.5,70.5 15.5,75.5 16.5,76.5 R7.2 17.05,83.55 17.5,84 U$19.6 25.5,84.04 25.5,85 26,85.5 27.5,85.5 28,86 | 76.56,78.44 START.RELAY2.85 76.46,62.5 74.5,62.5 74,62 | 51,68 U$7.PIN2 55.5,68 56,67.5 56,63 56.5,62.5 | U$19.SH1 28.4,93.4 28,93 | 56.5,62.5 56.59,62.41 56,61.81 R15.2 | 122,24.5 120.5,23 119.5,23 119,22.5 | 122,24.5 122,29.5 120.5,31 112.5,31 111.5,32 111.5,40.5 111,41 109.5,41 109,41.5 109,47 108,48 108,49 109,50 111,50 111.5,49.5 | 111.5,49.5 U$8.PIN2 111.65,48.25 C1.2 | 111.5,49.5 112,50 116.5,50 117,49.5 CR4.2 | FC.GND.P$6 57.42,2.92 | U$4.GND 24,34.5 24.5,34 24.5,21 25,20.5 40,20.5 v41,21.5 | R16.2 17.05,65.45 17.5,65 24.5,65 25,64.5 CR3.2 | 28,93 27.6,93.4 U$19.SH2 | R2.2 72.05,58.5 73.5,58.5 74,59 74,62 | 56.5,62.5 73.5,62.5 74,62 | R4.2 104.05,22.55 | 104.05,22.55 104.5,23 118.5,23 119,22.5 | 119,22.5 118.95,22.45 R14.2 118.95,20.16 v119,20.11 | 104.05,22.55 103.6,23 98.5,23 98,23.5 98,24.5 97.5,25 89,25 88.5,25.5 88.5,27.5 88.59,27.59 START.RELAY1.85 | 122,24.5 124,24.5 125.5,23 125.5,21 126,20.5 137,20.5 137.5,21 U$15.P$1 | CR1.2 142,26.5 v141,25.5 | 28,86 28.5,85.5 31.5,85.5 v32,85 32.5,85.5 42.5,85.5 | 28,86 28,93
  Bottom 0.305: 51,68 49.65,68 C2.2 49.5,78.5 42.5,85.5 | C3.2 60.85,30.75 U$9.PIN2
  Bottom 1.27: v132.5,91 U$13.(--) | 41,23.25 v41,21.5 U$14.(--) | U$22.LED- 82.69,4.19 81.5,3 68.66,3 FC.GND.P$6 | START.RELAY1.30 87.55,28.55 START.RELAY1.85
  pour Top (rank 3, no thermals): 0,0 0,19 1,20 26,20 32,26 32,39 33,40 72,40 73,41 84,41 85,40 85,34 84,33 73,33 71.5,31.5 71.5,0
ISO_GND  (via drill 0.35)
  Top 0.254: FCC_2.P$13 122.35,7.35 122,7 122,2 122.5,1.5 138.5,1.5 139,2 139,8.94 FCC_2.P$14 138.83,9.33 139.5,10 150.26,10 FCC_1.P$13 150.7,15 | 150.7,15 150.7,15.14 FCC_1.P$7 | 150.7,15 FCC_1.P$8 | v138,27 150.4,27 FCC_1.P$14
  Bottom 0.254: U$4.CATHODE 45.5,34.5 46,34 46,19.5 46.5,19 61.5,19 62,18.5 62,17.5 62.5,17 121.5,17 122,16.5 122,10.5 122.35,10.15 FCC_2.P$13 | U$2.CATHODE 131,84.5 130.5,84 130.5,75.5 131,75 | 131,75 130.5,74.5 130.5,66 131,65.5 U$6.CATHODE 132.63,65.36 134.5,63.5 134.5,56 134,55.5 124,55.5 123.5,55 123.5,27.5 124,27 130.5,27 131,26.5 131,26 131.5,25.5 135.5,25.5 136,26 136,26.5 136.5,27 v138,27 | U$12.CATHODE 131,75 | FCC_1.P$7 157.53,16.03 158,16.5 158,26.5 157.5,27 151,27 FCC_1.P$14
MOTOR_C_SENSOR  (via drill 0.35, 0.65)
  Top 0.254: U$9.PIN5 59.78,52 59.4,51.62 59.31,51.39 59.19,51.17 59.02,50.98 58.83,50.81 58.61,50.69 58.38,50.6 58.2,50.57 58.18,50.56 53.82,50.56 53.8,50.57 53.62,50.6 53.39,50.69 53.17,50.81 52.98,50.98 52.81,51.17 52.69,51.39 52.6,51.62 52.22,52 v50,52
  Top 1.27: U$14.NO(--) v35,46.5
  Bottom 0.254: 52.45,60.45 R8.1 52.95,60.5 50.5,60.5 50,60 v50,52
  Bottom 1.27: 35,48.05 v35,46.5 U$14.NO(--)
  pour Top (rank 2, no thermals): 25,56 25,43 28,40 60,40 61,41 61,55 60,56
MOTOR_CURR
  Bottom 0.254: U$9.PIN3 73.4,30.6 74,30 74,27.5 77,24.5 83,24.5 86.5,21 99.5,21 100,20.5 100,18.5 100.5,18 125.5,18 126,18.5 127,18.5 127.5,18 127.5,14 127,13.5 126,13.5 125.5,13 125.5,9 127.5,7 129.5,7 130,7.5 130,8.42 FCC_2.P$5
MOTOR_POS  (via drill 0.65)
  Top 1.27: 15,47 v15,46.5 | 15,47 15,48.05 15,47 | U$14.NO(++) 15,47
  Bottom 1.27: U$14.NO(++) v15,46.5
  pour Top (no thermals): 0,81 0,49 0,43 3,40 22,40 25,43 25,68 19,68 16,71 16,80 15,81
MOTOR_R  (via drill 0.35)
  Top 0.254: FCC_1.P$4 149.72,19 v142,19
  Bottom 0.254: R10.2 28.35,41.65 28,42 25.5,42 25,41.5 25,34 25.5,33.5 45,33.5 45.5,33 45.5,19 46,18.5 61,18.5 61.5,18 61.5,17 62,16.5 117.5,16.5 118,16 118,3.5 118.5,3 141,3 141.5,3.5 141.5,18.5 v142,19
MOTOR_VOLT  (via drill 0.35)
  Top 0.254: v132.5,19 130,19 v130,18.89
  Bottom 0.254: R8.2 53,57 53.5,56.5 63.5,56.5 64,57 | 64,57 S3.2 | 64,57 64.5,56.5 75.5,56.5 76,56 76,28.5 78,26.5 84,26.5 86.5,24 96.5,24 97,23.5 97,22 97.5,21.5 100,21.5 100.5,21 100.5,19 101,18.5 125,18.5 125.5,19 129.89,19 v130,18.89 | FCC_2.P$2 133.04,18.46 v132.5,19
N$1
  Bottom 0.254: U$2.VO 122.54,81.96 122,82.5 122,85 121.5,85.5 120.5,85.5 120,86 120,88.5 | R9.1 119.15,89.35 119.5,89 | 119.5,89 119.55,88.95 | U$1.G 120.95,89 120.5,89 120,88.5 | 120,88.5 119.5,89
N$2
  Bottom 0.254: 132.68,87 U$2.ANODE 132.82,86.85 R3.1
N$3
  Bottom 0.152: 100.5,81 CR2.1
  Bottom 0.254: 93.44,80.5 START.RELAY2.86 | 93.44,80.5 93.44,80.53 | 100.5,81 101,80.5 101,76.5 101.5,76 109.5,76 110,76.5 110,87.5 110.5,88 U$1.D | CR2.1 93.44,80.53 | 93.44,80.53 93.44,80.5
N$4
  Bottom 0.254: R11.1 23.35,36.35 23,36 19,36 18.5,35.5 18.5,32.5 | 18.5,32.5 17.96,31.96 14.54,31.96 14,32.5 U$3.G | 18.5,32.5 19,32 20.32,32 U$4.VO
N$5
  Bottom 0.254: R10.1 26.65,40.02 U$4.ANODE
N$6  (via drill 0.65)
  Top 1.27: 9,23.25 v9,22 U$14.(++)
  Bottom 0.254: 8.5,34 8.5,29.34 8.47,29.33 8.28,29.22 8.12,29.08 7.98,28.92 7.87,28.73 7.79,28.52 7.77,28.4 7.75,28.38 7.75,24.82 7.77,24.8 7.79,24.68 7.87,24.47 7.98,24.28 8.12,24.12 8.28,23.98 8.47,23.87 8.68,23.79 8.71,23.79 U$14.(++) | CR3.1 5.09,34.91 5.5,34.5 8,34.5 8.5,34 | U$3.D 9,34.5 8.5,34
  Bottom 1.27: U$14.(++) v9,22
N$7
  Bottom 0.254: U$6.VO 123.33,63 122.5,63 122,63.5 122,66 121.5,66.5 120.5,66.5 120,67 120,69 120.95,69.95 U$5.G 121,70.5 120.5,71 119.5,71 119.15,71.35 R13.1 119.15,71.8
N$8
  Bottom 0.254: U$6.ANODE 132.82,67.85 R12.1
N$9
  Bottom 0.254: R4.1 108.06,21.5 S1.1
N$10
  Bottom 0.254: S1.3 116.55,21 R14.1
N$11
  Bottom 0.254: S3.1 71.05,59.5 R2.1
N$12
  Bottom 0.254: R15.1 60.51,58.55 S3.3
N$13  (via drill 0.65)
  Top 0.254: CR4.1 137,48.09 137,50.5 136.5,51 132,51 131.5,51.5 U$13.(++)
  Top 1.27: v132.5,59 U$13.(++)
  Bottom 0.254: U$5.D 119,66.5 119.5,66 121,66 121.5,65.5 121.5,62 122,61.5 131,61.5 131.5,61 U$13.(++)
  Bottom 1.27: U$13.(++) v132.5,59
N$16
  Bottom 0.254: R7.1 22.44,76.5 S2.1
N$17
  Bottom 0.254: R16.1 22.64,69.5 S2.3
N$21
  Bottom 0.254: 122.95,72.46 U$12.VO 122.54,72.46 122,73 122,75.5 121.5,76 120.5,76 120,76.5 120,78.5 120.95,79.45 | 120.95,79.45 U$11.G | R1.1 119.15,80.85 119.5,80.5 120.5,80.5 120.95,80.05 120.95,79.45
N$23
  Bottom 0.254: U$12.ANODE 132.82,77.35 R18.1
N$30  (via drill 0.35)
  Top 0.254: v119,76 119,75 118.5,74.5 115.5,74.5 115,74 115,45 115.5,44.5 141,44.5 142,45.5 CR1.1
  Bottom 0.254: 88.5,45.35 START.RELAY1.86 97.44,45.45 98,46 98,75 98.5,75.5 110,75.5 110.5,76 110.5,78 111,78.5 U$11.D v119,76
POWER_BOARD
  Bottom 1.27: U$22.6 U$22.5 57.05,22.45 55.5,24 49,24 48,25 48,63.5 47,64.5 47,69.5 48,70.5 48,75 46,77 36.5,77 35,78.5 35,82.5 34,83.5 31,83.5 30.54,83.96 | 30.54,83.96 U$19.4 | 30.54,83.96 30.54,83.54 29.5,82.5 29.5,81.69 U$19.2 U$19.3 | U$19.5 28.04,83.96 30.54,83.96
START_R  (via drill 0.35)
  Top 0.254: v130.5,28.5 130.5,29 131,29.5 156.5,29.5 157,29 157,18.5 156.57,18.07 FCC_1.P$5
  Bottom 0.254: R18.2 135.15,75.5 136,75.5 136.5,75 136.5,65.5 135.5,64.5 135.5,55 135,54.5 125,54.5 124.5,54 124.5,28.5 125,28 130,28 v130.5,28.5

### Text on the board
tNames: Cap Relay | FC (+) | BYPASS (+) | BYPASS (-) | RESISTOR (+) | MOTOR (+) | Charge Relay | Fuel Cell Current / Sensor | Motor Relay | CAP (+) | Start Relay | Motor Current / Sensor | Cap Current / Sensor | RESISTOR (-) | GND | GND | GND